# Altium project MarlinHardware.PrjPcb
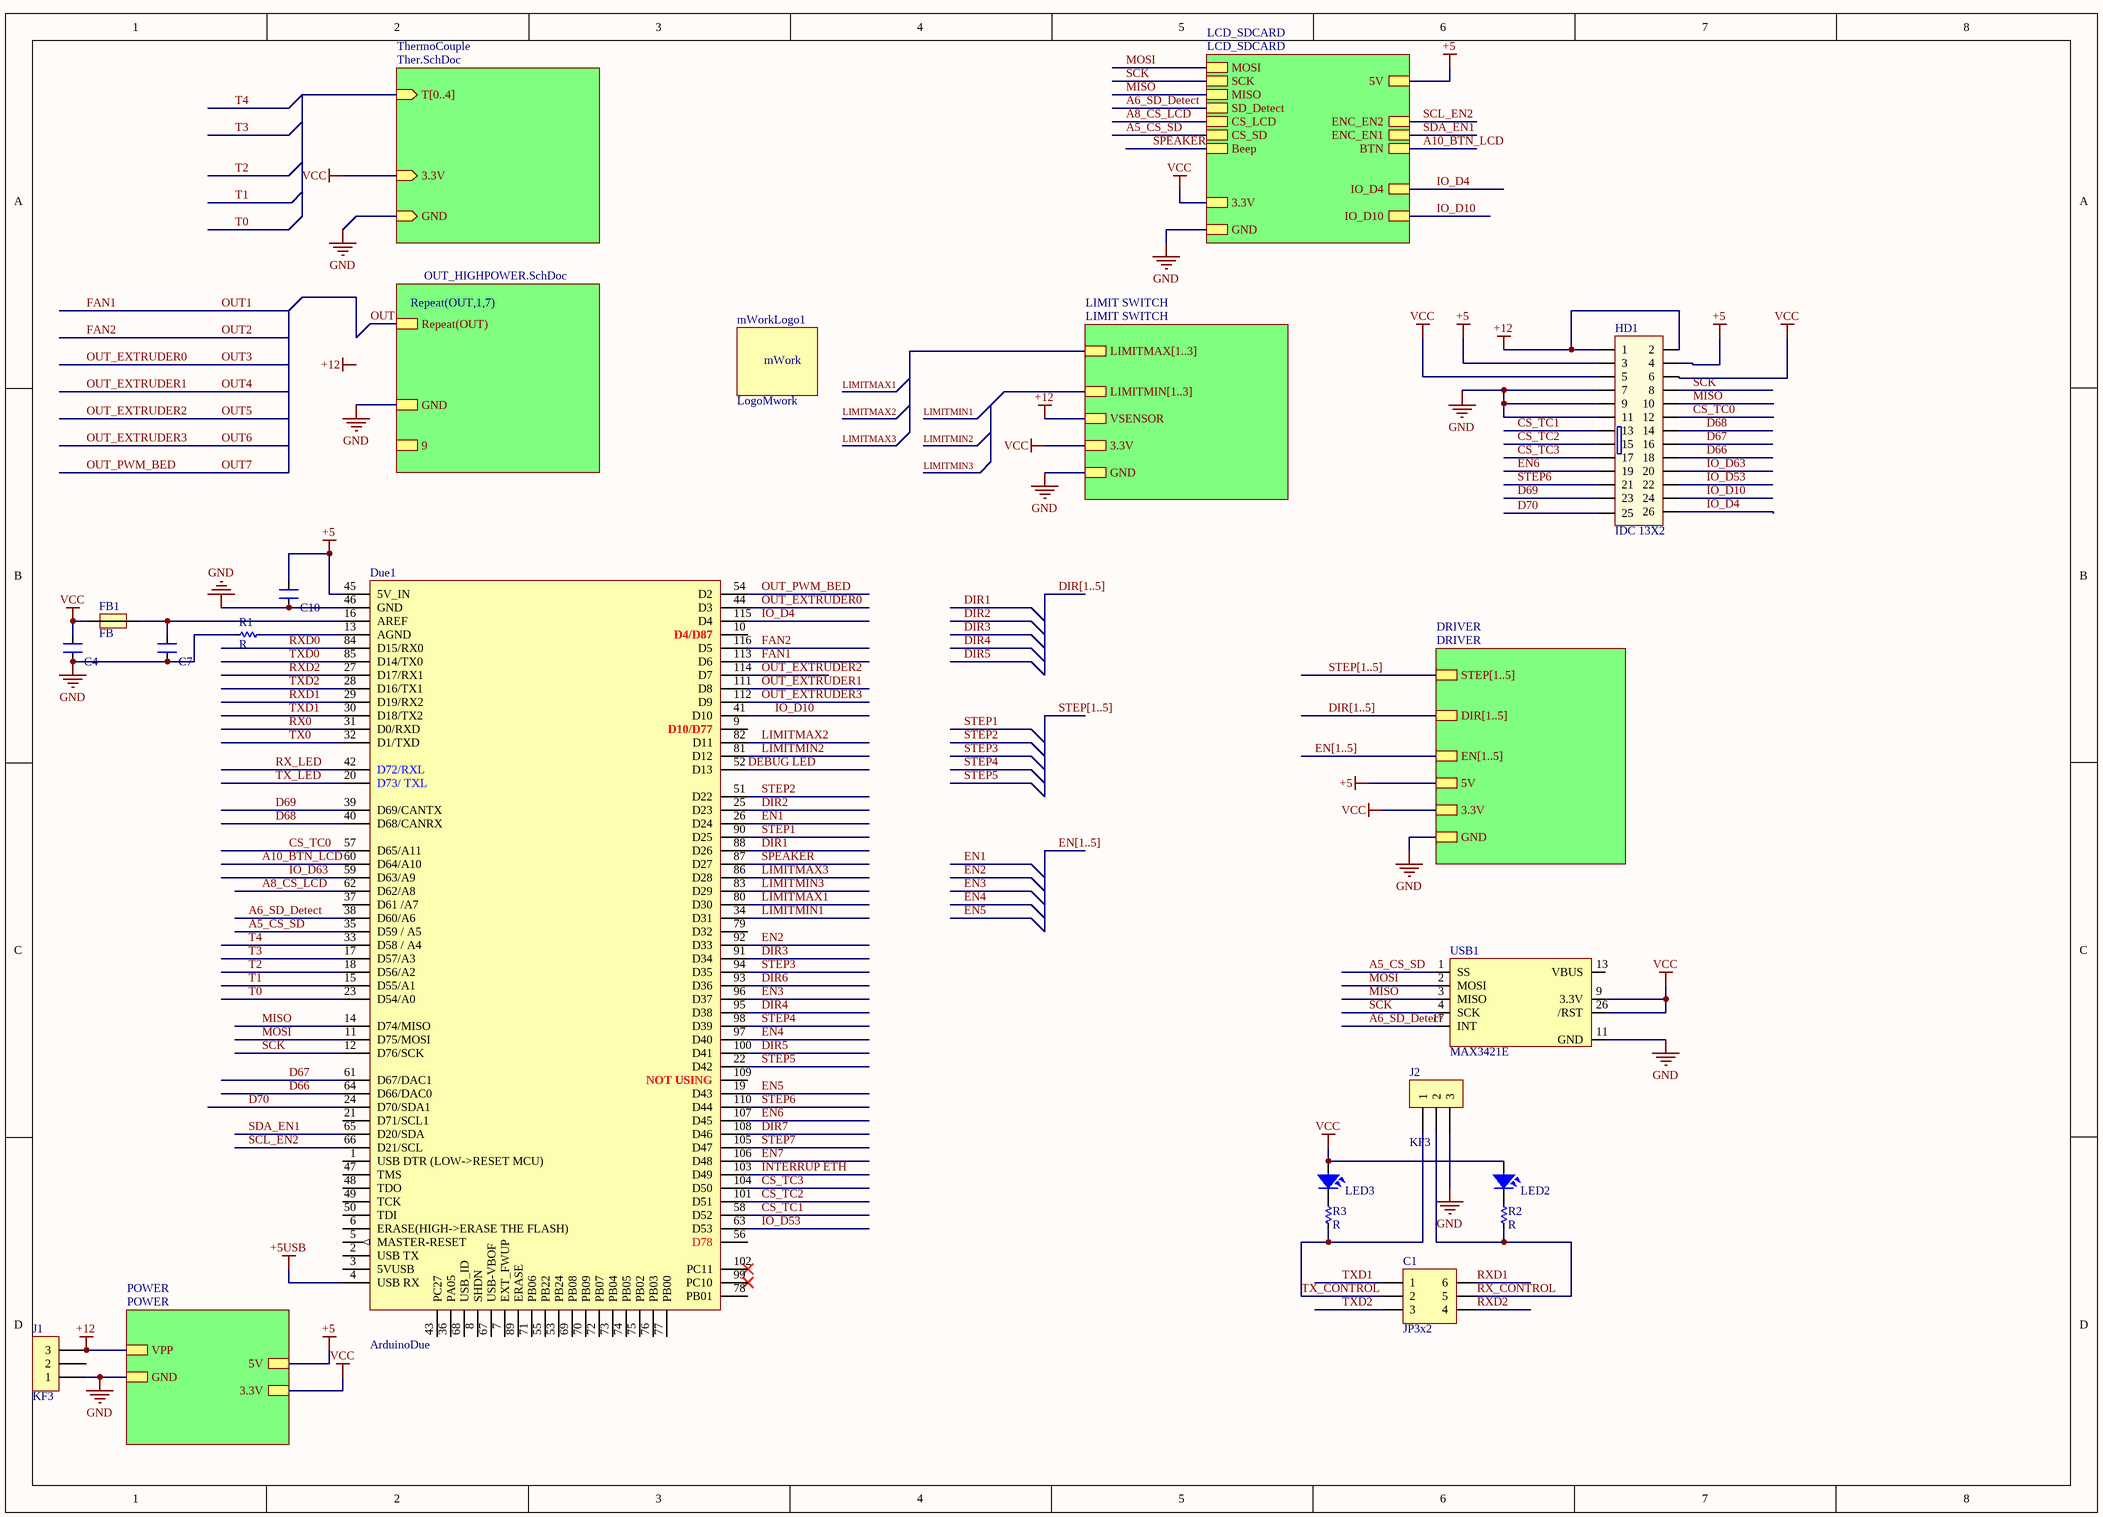
[diagram p0: mainMARLIN.SchDoc]
12 sheets, 297 parts. Net scope: hierarchical (ports join the sheet entries above them; power ports are global).
Board file: MARLIN.PcbDoc
Sheets:
  mainMARLIN.SchDoc
    POWER = POWER.SchDoc
    DRIVER = DRIVER.SchDoc
      Driver1 = DriverAxis.SchDoc
      Driver2 = DriverAxis.SchDoc
      Driver3 = DriverAxis.SchDoc
      Driver4 = DriverAxis.SchDoc
      Driver5 = DriverAxis.SchDoc
    LIMIT SWITCH = LIMIT SWITCH.SchDoc
      IN1 = inopto.SchDoc
      IN2 = inopto.SchDoc
      IN3 = inopto.SchDoc
      IN4 = inopto.SchDoc
      IN5 = inopto.SchDoc
      IN6 = inopto.SchDoc
    ThermoCouple = Ther.SchDoc
    OUT1 = OUT_HIGHPOWER.SchDoc
    OUT2 = OUT_HIGHPOWER.SchDoc
    OUT3 = OUT_HIGHPOWER.SchDoc
    OUT4 = OUT_HIGHPOWER.SchDoc
    OUT5 = OUT_HIGHPOWER.SchDoc
    OUT6 = OUT_HIGHPOWER.SchDoc
    OUT7 = OUT_HIGHPOWER.SchDoc
    LCD_SDCARD = LCD_SDCARD.SchDoc
  INOUT.SchDoc
  OUT.SchDoc
  IN.SchDoc

## Sheet mainMARLIN.SchDoc
size A3

### Parts
C1  JP3x2  [JP3-D2T]
C4  CN  [CN-SMD-0603_big]  (value not drawn)
C7  CN  [CN-SMD-0603_big]  (value not drawn)
C10  CN  [CN-SMD-0603_big]  (value not drawn)
Due1  ArduinoDue  [DUE_MODULE_SMT]
FB1  FB  [Capacitor_805]
HD1  IDC 13X2  [IDC26-B]
J1  KF3  [KF3-5.08T]
J2  KF3  [KF3-5.08T]
LED2  LED  [LED-0805-Blue]  (value not drawn)
LED3  LED  [LED-0805-Blue]  (value not drawn)
mWorkLogo1  LogoMwork  [LogoMwork15*6]
R1  R  [RES-SMD-0603_BIG]
R2  R  [RES-SMD-0603_BIG]
R3  R  [RES-SMD-0603_BIG]
USB1  MAX3421E  [USB_SHIELD]

### Sub-sheets
DRIVER = DRIVER: STEP[1..5], DIR[1..5], EN[1..5], GND, 5V, 3.3V
LCD_SDCARD = LCD_SDCARD: MOSI, ENC_EN1, 5V, MISO, SD_Detect, CS_LCD, ENC_EN2, BTN, CS_SD, 3.3V, SCK, GND, IO_D4, IO_D10, Beep
LIMIT SWITCH = LIMIT SWITCH: LIMITMAX[1..3], LIMITMIN[1..3], 3.3V, GND, VSENSOR
POWER = POWER: VPP, 5V, GND, 3.3V
Repeat(OUT,1,7) = OUT_HIGHPOWER.SchDoc: Repeat(OUT), GND, 9
ThermoCouple = Ther.SchDoc: T[0..4] (in), 3.3V (in), GND (in)

### Nets
+5: C10.2 Due1.45(5V_IN) HD1.3 HD1.4 ; sheet POWER/5V, sheet DRIVER/5V, sheet LCD_SDCARD/5V  [project net 5V]
+5USB: Due1.4(USB_RX)
+12: HD1.1 HD1.2 J1.3 ; sheet POWER/VPP, sheet LIMIT SWITCH/VSENSOR
GND: C4.1 C7.1 C10.1 Due1.46(GND) HD1.7 HD1.9 HD1.11 J1.1 J2.3 R1.2 USB1.11(GND) ; sheet POWER/GND, sheet DRIVER/GND, sheet LIMIT SWITCH/GND, sheet ThermoCouple/GND, sheet Repeat(OUT,1,7)/GND, sheet LCD_SDCARD/GND
VCC: C4.2 FB1.1 HD1.5 HD1.6 LED2.1 LED3.1 USB1.9(3.3V) USB1.26(/RST) ; sheet POWER/3.3V, sheet DRIVER/3.3V, sheet LIMIT SWITCH/3.3V, sheet ThermoCouple/3.3V, sheet LCD_SDCARD/3.3V  [project net 3.3V]
A5_CS_SD: Due1.35(D59_/_A5) USB1.1(SS) ; sheet LCD_SDCARD/CS_SD
A6_SD_Detect: Due1.38(D60/A6) USB1.17(INT) ; sheet LCD_SDCARD/SD_Detect
A8_CS_LCD: Due1.62(D62/A8) ; sheet LCD_SDCARD/CS_LCD
A10_BTN_LCD: Due1.60(D64/A10) ; sheet LCD_SDCARD/BTN
CS_TC0: Due1.57(D65/A11) HD1.12
CS_TC1: Due1.58(D52) HD1.13
CS_TC2: Due1.101(D51) HD1.15
CS_TC3: Due1.104(D50) HD1.17
D66: Due1.64(D66/DAC0) HD1.18
D67: Due1.61(D67/DAC1) HD1.16
D68: Due1.40(D68/CANRX) HD1.14
D69: Due1.39(D69/CANTX) HD1.23
D70: Due1.24(D70/SDA1) HD1.25
DEBUG LED: Due1.52(D13)
DIR1: Due1.88(D26)
DIR2: Due1.25(D23)
DIR3: Due1.91(D34)
DIR4: Due1.95(D38)
DIR5: Due1.100(D41)
DIR6: Due1.93(D36)
DIR7: Due1.108(D46)
EN1: Due1.26(D24)
EN2: Due1.92(D33)
EN3: Due1.96(D37)
EN4: Due1.97(D40)
EN5: Due1.19(D43)
EN6: Due1.107(D45) HD1.19
EN7: Due1.106(D48)
FAN1: Due1.113(D6)  [also labelled OUT1]
FAN2: Due1.116(D5)  [also labelled OUT2]
INTERRUP ETH: Due1.103(D49)
IO_D4: Due1.115(D4) HD1.26 ; sheet LCD_SDCARD/IO_D4
IO_D10: Due1.41(D10) HD1.24 ; sheet LCD_SDCARD/IO_D10
IO_D53: Due1.63(D53) HD1.22
IO_D63: Due1.59(D63/A9) HD1.20
LIMITMAX1: Due1.80(D30)
LIMITMAX2: Due1.82(D11)
LIMITMAX3: Due1.86(D28)
LIMITMIN1: Due1.34(D31)
LIMITMIN2: Due1.81(D12)
LIMITMIN3: Due1.83(D29)
MISO: Due1.14(D74/MISO) HD1.10 USB1.3(MISO) ; sheet LCD_SDCARD/MISO
MOSI: Due1.11(D75/MOSI) USB1.2(MOSI) ; sheet LCD_SDCARD/MOSI
OUT: sheet Repeat(OUT,1,7)/Repeat(OUT)
OUT3: Due1.44(D3)  [also labelled OUT_EXTRUDER0]
OUT4: Due1.111(D8)  [also labelled OUT_EXTRUDER1]
OUT5: Due1.114(D7)  [also labelled OUT_EXTRUDER2]
OUT6: Due1.112(D9)  [also labelled OUT_EXTRUDER3]
OUT7: Due1.54(D2)  [also labelled OUT_PWM_BED]
RX0: Due1.31(D0/RXD)
RX_CONTROL: C1.5 J2.2 R2.1
RX_LED: Due1.42(D72/RXL)
RXD0: Due1.84(D15/RX0)
RXD1: C1.6 Due1.29(D19/RX2)
RXD2: C1.4 Due1.27(D17/RX1)
SCK: Due1.12(D76/SCK) HD1.8 USB1.4(SCK) ; sheet LCD_SDCARD/SCK
SCL_EN2: Due1.66(D21/SCL) ; sheet LCD_SDCARD/ENC_EN2  [project net ENC_EN2]
SDA_EN1: Due1.65(D20/SDA) ; sheet LCD_SDCARD/ENC_EN1  [project net ENC_EN1]
SPEAKER: Due1.87(D27) ; sheet LCD_SDCARD/Beep  [project net LCD_Beep]
STEP1: Due1.90(D25)
STEP2: Due1.51(D22)
STEP3: Due1.94(D35)
STEP4: Due1.98(D39)
STEP5: Due1.22(D42)
STEP6: Due1.110(D44) HD1.21
STEP7: Due1.105(D47)
T0: Due1.23(D54/A0)
T1: Due1.15(D55/A1)
T2: Due1.18(D56/A2)
T3: Due1.17(D57/A3)
T4: Due1.33(D58_/_A4)
TX0: Due1.32(D1/TXD)
TX_CONTROL: C1.2 J2.1 R3.1
TX_LED: Due1.20(D73/_TXL)
TXD0: Due1.85(D14/TX0)
TXD1: C1.1 Due1.30(D18/TX2)
TXD2: C1.3 Due1.28(D16/TX1)
NetC7_2: C7.2 Due1.16(AREF) FB1.2
NetDue1_13: Due1.13(AGND) R1.1
NetLED2_2: LED2.2 R2.2
NetLED3_2: LED3.2 R3.2

Not connected (* = marked no-connect by the designer): Due1 1(USB_DTR_(LOW->RESET_MCU)) 2(USB_TX) 3(5VUSB) 5(MASTER-RESET) 6(ERASE(HIGH->ERASE_THE_FLASH)) 7(EXT_FWUP) 8(SHDN) 9(D10/D77) 10(D4/D87) 21(D71/SCL1) 36(PA05) 37(D61_/A7_) 43(PC27) 47(TMS) 48(TDO) 49(TCK) 50(TDI) 53(PB24) 55(PB22) 56(D78) 67(USB-VBOF) 68(USB_ID) 69(PB08) 70(PB09) 71(PB06) 72(PB07) 73(PB04) 74(PB05) 75(PB02) 76(PB03) 77(PB00) 78(PB01) 79(D32) 89(ERASE) 99(PC10)* 102(PC11)* 109(NOT_USING); J1 2; USB1 13(VBUS)

### Buses and harness runs
bus DIR[1..5]
bus DIR[1..5] = sheet DRIVER/DIR[1..5]
bus EN[1..5]
bus EN[1..5] = sheet DRIVER/EN[1..5]
bus STEP[1..5]
bus STEP[1..5] = sheet DRIVER/STEP[1..5]

### Notes on the sheet
- Labels drawn without touching a wire or pin: +12
- (in symbol LogoMwork) mWork

### Library data of the parts
C1 = JP3x2: WR-PHD 2.54 mm Dual Socket Header; Manufacturer: W¨¹rth Elektronik eiSos GmbH; partNo: 61300621821; ComponentLink1 Description: Manufacturer; ComponentLink2 Description: Datasheet; NoPins: 06; Created Date: 29 March 2013; ComponentLink1URL: http://www.we-online.com; ComponentLink2URL: http://katalog.we-online.de/em/datasheet/6130xx21821.pdf; Created by: Karrer Zheng
C4 C7 C10 = CN: Value: 33pF
HD1 = IDC 13X2: Value: Header 5x2
J1 J2 = KF3: Manufacturer: Würth Elektronik eiSos GmbH; partNo: 691103110003; ComponentLink1 Description: Manufacturer; ComponentLink2 Description: Datasheet; NoPins: 3; Created Date: 29 October 2013; ComponentLink1URL: http://www.we-online.com; ComponentLink2URL: http://katalog.we-online.de/em/datasheet/6911031100xx.pdf; Created by: Karrer Zheng
LED2 LED3 = LED SMD: Value: LED 3 - 5 ly 2 Colour
USB1 = USB_Shield_MAX3421E
Due1 = ArduinoDue: ComponentLink1Description: Buy; ComponentLink1URL: http://www.inhaos.com/product_info.php?products_id=164

## Sheet POWER.SchDoc
size A4
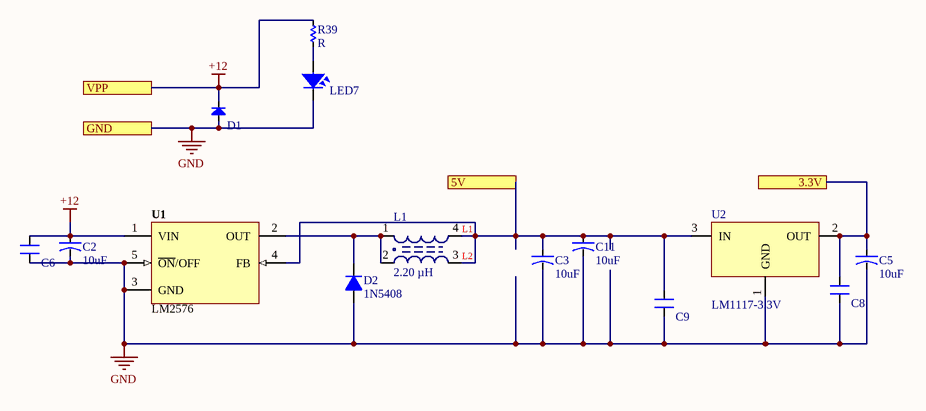
[diagram p1: POWER.SchDoc]

### Parts
C2  10uF  [CAP-ALU-SMD-6.3x7.7x2.2]
C3  10uF  [CAP-ALU-SMD-6.3x7.7x2.2]
C5  10uF  [CAP-ALU-SMD-6.3x7.7x2.2]
C6  CN  [CN-SMD-0603_big]  (value not drawn)
C8  CN  [CN-SMD-0603_big]  (value not drawn)
C9  CN  [CN-SMD-0603_big]  (value not drawn)
C11  10uF  [CAP-ALU-SMD-6.3x7.7x2.2]
D1  Diode  [DIO-SMD-214AC]  (value not drawn)
D2  1N5408  [D5AN]
L1  2.20 µH  [L-SMD-D-12.5x12.5]
LED7  LED  [LED-0805-Blue]  (value not drawn)
R39  R  [RES-SMD-0603_BIG]
U1  LM2576  [TO263]
U2  LM1117-3.3V  [SOT223]

### Ports
3.3V, 5V, GND, VPP

### Nets
3.3V: C5.1 C8.2 U2.2(OUT) ; port 3.3V
5V: C3.1 C9.2 C11.1 L1.3 L1.4 U1.4(FB) U2.3(IN) ; port 5V
+12: C2.1 C6.2 D1.2(K) R39.1 U1.1(VIN) ; port VPP
GND: C2.2 C3.2 C5.2 C6.1 C8.1 C9.1 C11.2 D1.1(A) D2.1(A) LED7.2 U1.3(GND) U1.5(~{ON}/OFF) U2.1(GND) ; port GND
NetD2_2: D2.2(K) L1.1 L1.2 U1.2(OUT)
NetLED7_1: LED7.1 R39.2

### Notes on the sheet
- (in symbol L-SMD-2) L2

### Library data of the parts
C2 C3 C5 C11 = CN-ALU-SMD: Polarized Capacitor (Axial); Published: 8-Jun-2000; LatestRevisionDate: 17-Jul-2002; LatestRevisionNote: Re-released for DXP Platform.; PackageReference: POLAR0.8; Publisher: Altium Limited
C6 C8 C9 = CN: Value: 33pF
D1 = Diode: Default Diode; Code - JEDEC: DO-214-AB; Value: 1N5007; Published: 8-Jun-2000; Revision: July-2002: Re-released for DXP Platform.; Publisher: Altium Limited; ComponentLink1Description: ES1J - STMBL; ComponentLink1URL: https://banlinhkien.vn/goods-8089-es1j-do214-diode-1a-600v-sma-es1j-.html
D2 = D5A: Diode 5A; Value: 1N5408
L1 = L-SMD-2: partNo: 7448709022; Manufacturer: Würth Elektronik eiSos GmbH; Inductance: 2.20 µH; ComponentLink1Description: Manufacturer; ComponentLink1URL: http://www.we-online.de; Created by: Christin Otto; Created Date: August 2013; ComponentLink2Description: Datasheet; ComponentLink2URL: http://katalog.we-online.de/pbs/datasheet/7448709022.pdf; ComponentLink3Description: THEGIOIIC; ComponentLink3URL: https://www.thegioiic.com/products/cuon-cam-33uh-rh127-smd-12x12x7
LED7 = LED SMD: Value: LED 3 - 5 ly 2 Colour
U1 = LM2576: Max Input Voltage: 12 V; Max Output Current: 3 (6.0 peak) A; Max Output Voltage: mV; Category: IC-Power; Min Input Voltage: mV; Min Output Voltage: mV; Mounting Technology: Surface Mount; Status: Unreleased; Supply Voltage: mV; Temperature Range: -40 to +125 degC; ComponentLink1Description: MUA; ComponentLink1URL: https://www.thegioiic.com/products/lm2596s-5-0
U2 = LM1117: 800mA Low-Dropout Linear Regulator; Creator: Nguyen Ba Bien; Website: http://group3i.net

## Sheet DRIVER.SchDoc
size A4
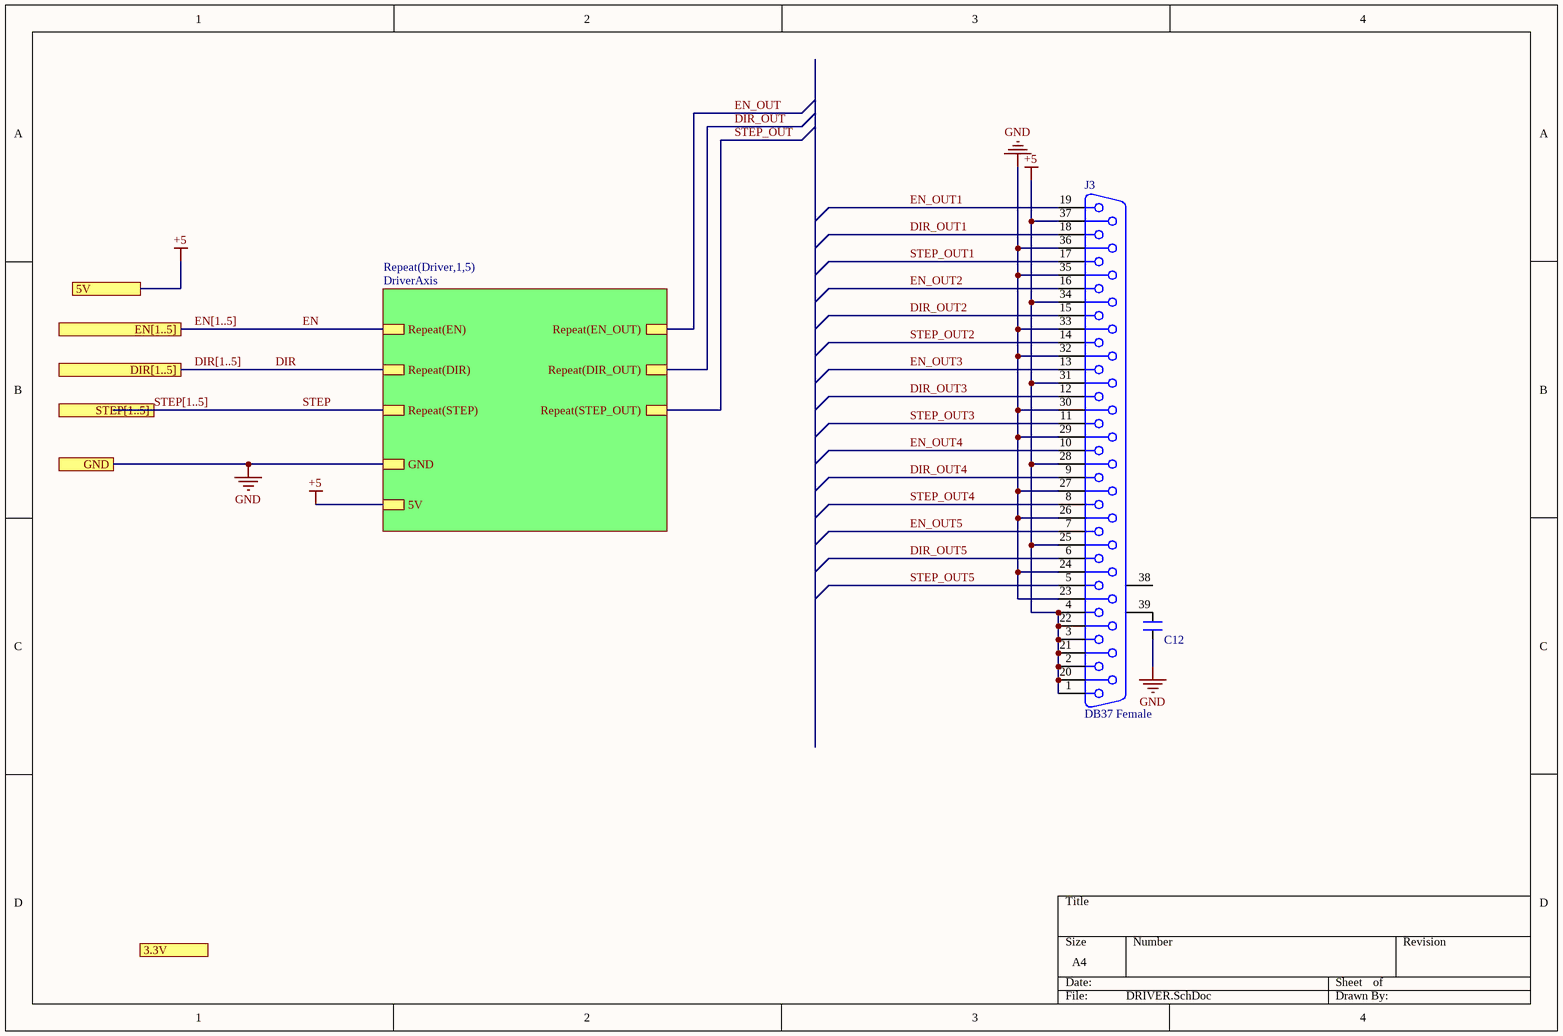
[diagram p2: DRIVER.SchDoc]

### Parts
C12  10uF  [CN-SMD-0603_big]  (value not drawn)
J3  DB37 Female  [DB37]

### Sub-sheets
Repeat(Driver,1,5) = DriverAxis: Repeat(EN), Repeat(DIR), Repeat(STEP), GND, Repeat(EN_OUT), Repeat(DIR_OUT), Repeat(STEP_OUT), 5V

### Ports
3.3V, 5V, DIR[1..5], EN[1..5], GND, STEP[1..5]

### Nets
+5: J3.1 J3.2 J3.3 J3.4 J3.20 J3.21 J3.22 J3.25 J3.28 J3.31 J3.34 J3.37 ; port 5V, sheet Repeat(Driver,1,5)/5V  [project net 5V]
GND: C12.1 J3.23 J3.24 J3.26 J3.27 J3.29 J3.30 J3.32 J3.33 J3.35 J3.36 ; port GND, sheet Repeat(Driver,1,5)/GND
DIR: sheet Repeat(Driver,1,5)/Repeat(DIR)
DIR_OUT: sheet Repeat(Driver,1,5)/Repeat(DIR_OUT)
DIR_OUT1: J3.18
DIR_OUT2: J3.15
DIR_OUT3: J3.12
DIR_OUT4: J3.9
DIR_OUT5: J3.6
EN: sheet Repeat(Driver,1,5)/Repeat(EN)
EN_OUT: sheet Repeat(Driver,1,5)/Repeat(EN_OUT)
EN_OUT1: J3.19
EN_OUT2: J3.16
EN_OUT3: J3.13
EN_OUT4: J3.10
EN_OUT5: J3.7
STEP: sheet Repeat(Driver,1,5)/Repeat(STEP)
STEP_OUT: sheet Repeat(Driver,1,5)/Repeat(STEP_OUT)
STEP_OUT1: J3.17
STEP_OUT2: J3.14
STEP_OUT3: J3.11
STEP_OUT4: J3.8
STEP_OUT5: J3.5
NetC12_2: C12.2 J3.39(MH2)

Not connected (* = marked no-connect by the designer): J3 38(MH1)

### Buses and harness runs
bus DIR[1..5] = port DIR[1..5]
bus EN[1..5] = port EN[1..5]
bus STEP[1..5] = port STEP[1..5]

### Library data of the parts
C12 = CN: Value: 33pF

## Sheet DriverAxis.SchDoc
size A
Used 5 times, as channels DRIVER/Driver1, DRIVER/Driver2, DRIVER/Driver3, DRIVER/Driver4, DRIVER/Driver5. Parts and nets are listed once, with the designators drawn on the sheet.
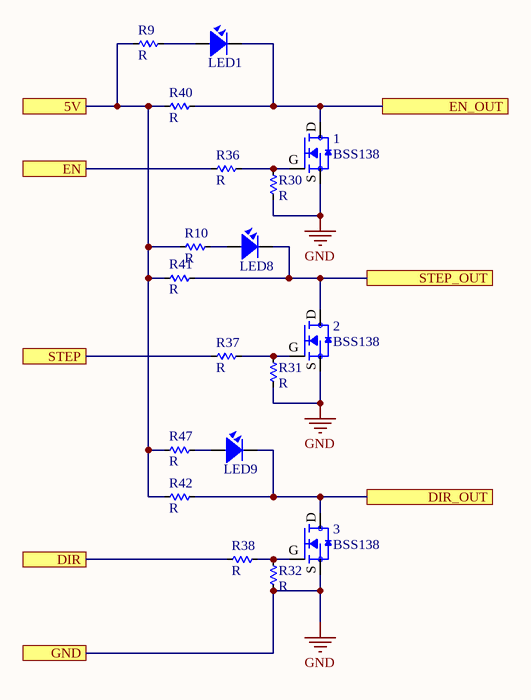
[diagram p3: DriverAxis.SchDoc]

### Parts
1  BSS138  [SOT23-bss138]
2  BSS138  [SOT23-bss138]
3  BSS138  [SOT23-bss138]
LED1  LED  [LED-0805-Blue]  (value not drawn)
LED8  LED  [LED-0805-Blue]  (value not drawn)
LED9  LED  [LED-0805-Blue]  (value not drawn)
R9  R  [RES-SMD-0603_BIG]
R10  R  [RES-SMD-0603_BIG]
R30  R  [RES-SMD-0603_BIG]
R31  R  [RES-SMD-0603_BIG]
R32  R  [RES-SMD-0603_BIG]
R36  R  [RES-SMD-0603_BIG]
R37  R  [RES-SMD-0603_BIG]
R38  R  [RES-SMD-0603_BIG]
R40  R  [RES-SMD-0603_BIG]
R41  R  [RES-SMD-0603_BIG]
R42  R  [RES-SMD-0603_BIG]
R47  R  [RES-SMD-0603_BIG]

### Ports
5V, DIR, DIR_OUT, EN, EN_OUT, GND, STEP, STEP_OUT

### Nets
GND: 1.S 2.S 3.S R30.2 R31.2 R32.2 ; port GND
5V: R9.1 R10.1 R40.1 R41.1 R42.1 R47.1 ; port 5V
DIR: R38.1 ; port DIR
DIR_OUT: 3.D LED9.2 R42.2 ; port DIR_OUT
EN: R36.1 ; port EN
EN_OUT: 1.D LED1.2 R40.2 ; port EN_OUT
STEP: R37.1 ; port STEP
STEP_OUT: 2.D LED8.2 R41.2 ; port STEP_OUT
Net1_G: 1.G R30.1 R36.2
Net2_G: 2.G R31.1 R37.2
Net3_G: 3.G R32.1 R38.2
NetLED1_1: LED1.1 R9.2
NetLED8_1: LED8.1 R10.2
NetLED9_1: LED9.1 R47.2

### Channels
DRIVER/Driver1: designators end in _Driver1; ports 5V=5V DIR=DIR1 DIR_OUT=DIR_OUT1 EN=EN1 EN_OUT=EN_OUT1 GND=GND STEP=STEP1 STEP_OUT=STEP_OUT1
DRIVER/Driver2: designators end in _Driver2; ports 5V=5V DIR=DIR2 DIR_OUT=DIR_OUT2 EN=EN2 EN_OUT=EN_OUT2 GND=GND STEP=STEP2 STEP_OUT=STEP_OUT2
DRIVER/Driver3: designators end in _Driver3; ports 5V=5V DIR=DIR3 DIR_OUT=DIR_OUT3 EN=EN3 EN_OUT=EN_OUT3 GND=GND STEP=STEP3 STEP_OUT=STEP_OUT3
DRIVER/Driver4: designators end in _Driver4; ports 5V=5V DIR=DIR4 DIR_OUT=DIR_OUT4 EN=EN4 EN_OUT=EN_OUT4 GND=GND STEP=STEP4 STEP_OUT=STEP_OUT4
DRIVER/Driver5: designators end in _Driver5; ports 5V=5V DIR=DIR5 DIR_OUT=DIR_OUT5 EN=EN5 EN_OUT=EN_OUT5 GND=GND STEP=STEP5 STEP_OUT=STEP_OUT5

### Library data of the parts
1-3 = BSS138: N-Channel 50V 220mA _Ta_ 360mW _Ta_ Surface Mount Die; MF: MICROSS/On Semiconductor; Value: *; SnapEDA_Link: https://www.snapeda.com/parts/BSS138/MICROSS/On%20Semiconductor/view-part/2773844/?ref=snap; MP: BSS138; Availability: Unavailable; Price: None; Package: TO-236-3 Micross
LED1 LED8 LED9 = LED SMD: Value: LED 3 - 5 ly 2 Colour

## Sheet LIMIT SWITCH.SchDoc
size A4
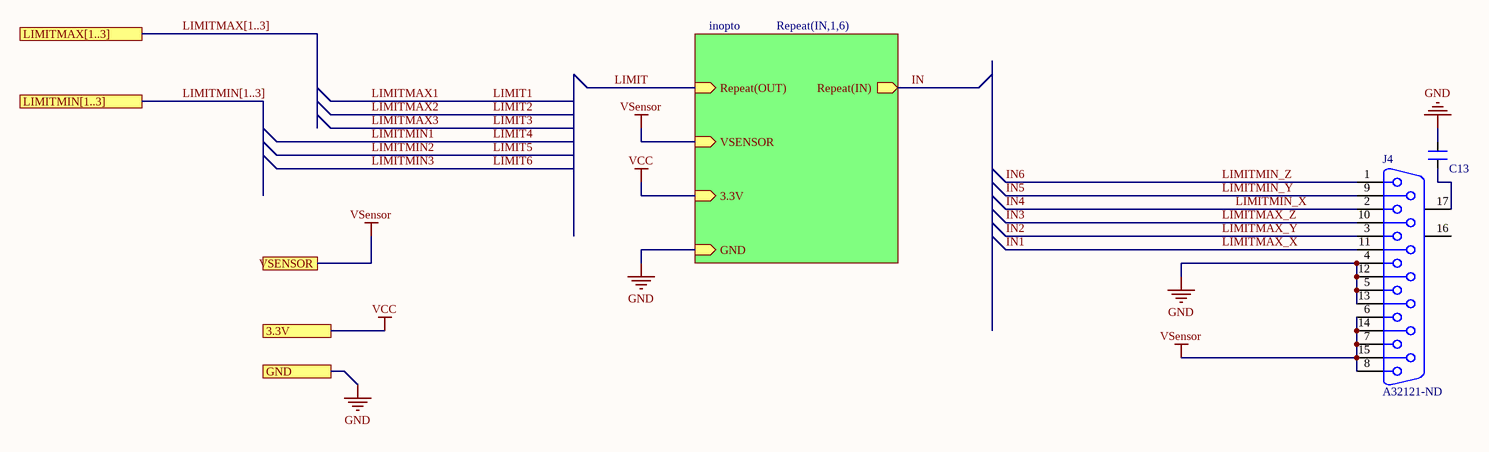
[diagram p4: LIMIT SWITCH.SchDoc]

### Parts
C13  CN  [CN-SMD-0603_big]  (value not drawn)
J4  A32121-ND  [DB15]

### Sub-sheets
Repeat(IN,1,6) = inopto: Repeat(OUT) (in), Repeat(IN) (out), VSENSOR (in), 3.3V (in), GND (in)

### Ports
3.3V, GND, LIMITMAX[1..3], LIMITMIN[1..3], VSENSOR

### Nets
GND: C13.2 J4.4 J4.5 J4.12 J4.13 ; port GND, sheet Repeat(IN,1,6)/GND
VCC: port 3.3V, sheet Repeat(IN,1,6)/3.3V  [project net 3.3V]
VSensor: J4.6 J4.7 J4.8 J4.14 J4.15 ; port VSENSOR, sheet Repeat(IN,1,6)/VSENSOR  [project net +12]
IN: sheet Repeat(IN,1,6)/Repeat(IN)
IN1: J4.11  [also labelled LIMITMAX_X]
IN2: J4.3  [also labelled LIMITMAX_Y]
IN3: J4.10  [also labelled LIMITMAX_Z]
IN4: J4.2  [also labelled LIMITMIN_X]
IN5: J4.9  [also labelled LIMITMIN_Y]
IN6: J4.1  [also labelled LIMITMIN_Z]
LIMIT: sheet Repeat(IN,1,6)/Repeat(OUT)
NetC13_1: C13.1 J4.17(MH2)

Not connected (* = marked no-connect by the designer): J4 16(MH1)

### Buses and harness runs
bus LIMITMAX[1..3] = port LIMITMAX[1..3]
bus LIMITMIN[1..3] = port LIMITMIN[1..3]

### Library data of the parts
C13 = CN: Value: 33pF
J4 = DB15: Receptacle Assembly, 15 Position, Right Angle; PackageDocument: O; Positions: 15; Published: 15-Jun-2001; LatestRevisionDate: 17-Jul-2002; LatestRevisionNote: Re-released for DXP Platform.; DatasheetDocument: 1-Sep-99; PackageReference: 788757; Publisher: Altium Limited; Orientation: Right Angle; Gender: Receptacle

## Sheet inopto.SchDoc
size A4
Used 6 times, as channels LIMIT SWITCH/IN1, LIMIT SWITCH/IN2, LIMIT SWITCH/IN3, LIMIT SWITCH/IN4, LIMIT SWITCH/IN5, LIMIT SWITCH/IN6. Parts and nets are listed once, with the designators drawn on the sheet.
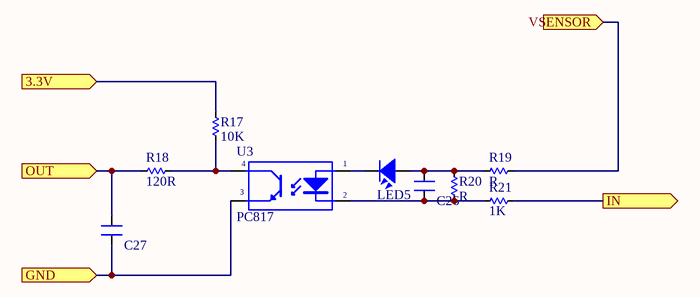
[diagram p5: inopto.SchDoc]

### Parts
C26  CN  [CN-SMD-0603_big]  (value not drawn)
C27  CN  [CN-SMD-0603_big]  (value not drawn)
LED5  MinZ  [LED-0805-Blue]  (value not drawn)
R17  10K  [RES-SMD-0603_BIG]
R18  120R  [RES-SMD-0603_BIG]
R19  R  [RES-SMD-0603_BIG]
R20  R  [RES-SMD-0603_BIG]
R21  1K  [RES-SMD-0603_BIG]
U3  PC817  [PC817SMT]

### Ports
3.3V (in), GND (in), IN (out), OUT (in), VSENSOR (in)

### Nets
3.3V: R17.1 ; port 3.3V
GND: C27.1 U3.3(E) ; port GND
IN: R21.1 ; port IN
OUT: C27.2 R18.1 ; port OUT
VSENSOR: R19.1 ; port VSENSOR
NetC26_1: C26.1 R20.2 R21.2 U3.2(K)
NetC26_2: C26.2 LED5.1 R19.2 R20.1
NetLED5_2: LED5.2 U3.1(A)
NetR17_2: R17.2 R18.2 U3.4(C)

### Channels
LIMIT SWITCH/IN1: designators end in _IN1; ports 3.3V=3.3V GND=GND IN=IN1 OUT=LIMIT1 VSENSOR=+12
LIMIT SWITCH/IN2: designators end in _IN2; ports 3.3V=3.3V GND=GND IN=IN2 OUT=LIMIT2 VSENSOR=+12
LIMIT SWITCH/IN3: designators end in _IN3; ports 3.3V=3.3V GND=GND IN=IN3 OUT=LIMIT3 VSENSOR=+12
LIMIT SWITCH/IN4: designators end in _IN4; ports 3.3V=3.3V GND=GND IN=IN4 OUT=LIMIT4 VSENSOR=+12
LIMIT SWITCH/IN5: designators end in _IN5; ports 3.3V=3.3V GND=GND IN=IN5 OUT=LIMIT5 VSENSOR=+12
LIMIT SWITCH/IN6: designators end in _IN6; ports 3.3V=3.3V GND=GND IN=IN6 OUT=LIMIT6 VSENSOR=+12

### Library data of the parts
C26 C27 = CN: Value: 33pF
LED5 = LED SMD: Value: LED 3 - 5 ly 2 Colour
R17 R18 R21 = R
U3 = PC817: Single Opto; Value: PC817

## Sheet Ther.SchDoc
size A4
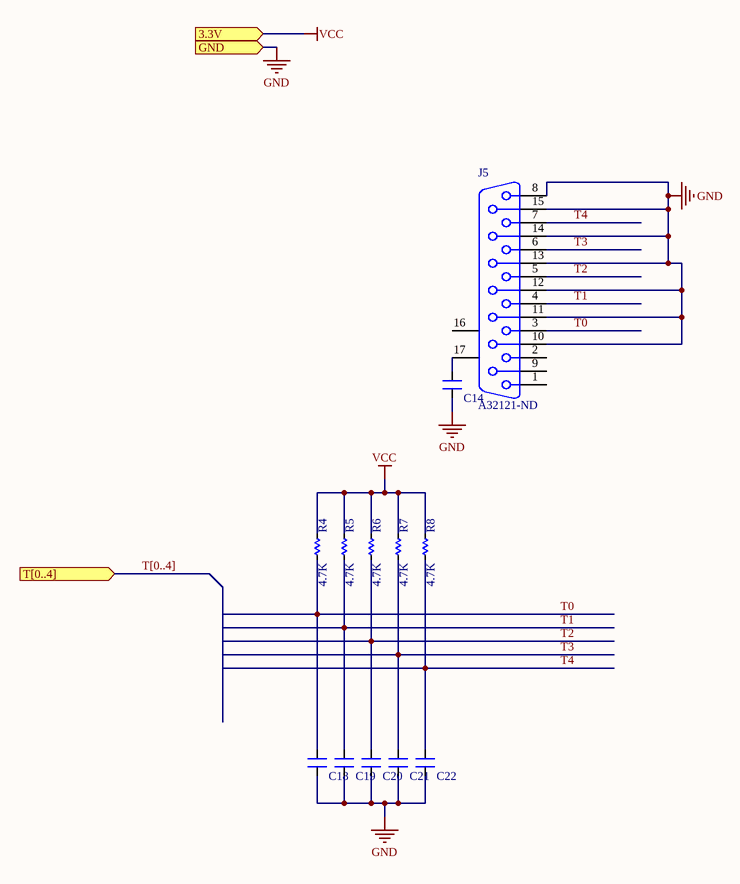
[diagram p6: Ther.SchDoc]

### Parts
C14  10uF  [CN-SMD-0603_big]  (value not drawn)
C18  10uF  [CN-SMD-0603_big]  (value not drawn)
C19  10uF  [CN-SMD-0603_big]  (value not drawn)
C20  10uF  [CN-SMD-0603_big]  (value not drawn)
C21  10uF  [CN-SMD-0603_big]  (value not drawn)
C22  10uF  [CN-SMD-0603_big]  (value not drawn)
J5  A32121-ND  [DB15]
R4  4.7K  [RES-SMD-0603_BIG]
R5  4.7K  [RES-SMD-0603_BIG]
R6  4.7K  [RES-SMD-0603_BIG]
R7  4.7K  [RES-SMD-0603_BIG]
R8  4.7K  [RES-SMD-0603_BIG]

### Ports
3.3V (in), GND (in), T[0..4] (in)

### Nets
GND: C14.1 C18.1 C19.1 C20.1 C21.1 C22.1 J5.8 J5.10 J5.11 J5.12 J5.13 J5.14 J5.15 ; port GND
VCC: R4.1 R5.1 R6.1 R7.1 R8.1 ; port 3.3V  [project net 3.3V]
T0: C18.2 J5.3 R4.2
T1: C19.2 J5.4 R5.2
T2: C20.2 J5.5 R6.2
T3: C21.2 J5.6 R7.2
T4: C22.2 J5.7 R8.2
NetC14_2: C14.2 J5.17(MH2)

Not connected (* = marked no-connect by the designer): J5 1 2 9 16(MH1)

### Buses and harness runs
bus T[0..4] = port T[0..4]

### Library data of the parts
C14 C18-C22 = CN: Value: 33pF
J5 = DB15: as J4 on sheet LIMIT SWITCH; Published: 15-Jun-2001; LatestRevisionDate: 17-Jul-2002; LatestRevisionNote: Re-released for DXP Platform.; DatasheetDocument: 1-Sep-99; PackageReference: 788757; Publisher: Altium Limited; Orientation: Right Angle; Gender: Receptacle
R4-R8 = R

## Sheet OUT_HIGHPOWER.SchDoc
size A4
Used 7 times, as channels OUT1, OUT2, OUT3, OUT4, OUT5, OUT6, OUT7. Parts and nets are listed once, with the designators drawn on the sheet.
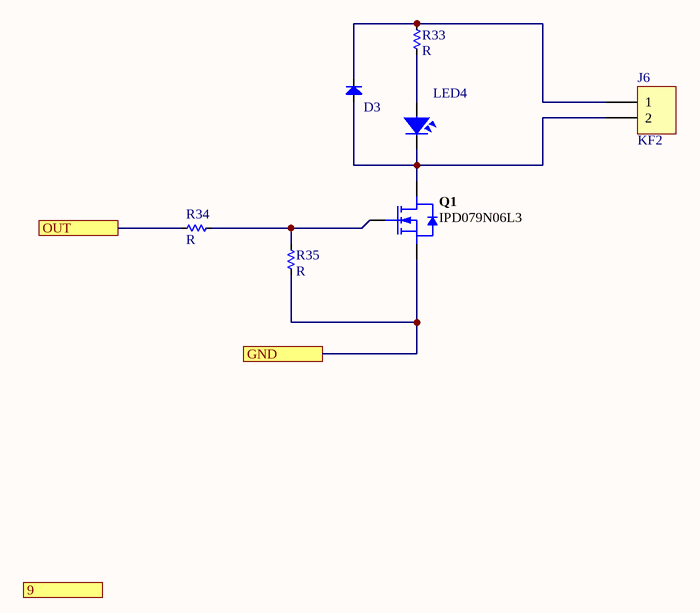
[diagram p7: OUT_HIGHPOWER.SchDoc]

### Parts
D3  Diode  [DIO-SMD-106-HayDung]  (value not drawn)
J6  KF2  [KF2-5.08T]
LED4  LED  [LED-0805-Blue]  (value not drawn)
Q1  IPD079N06L3  [TO252-3]
R33  R  [RES-SMD-0603_BIG]
R34  R  [RES-SMD-0603_BIG]
R35  R  [RES-SMD-0603_BIG]

### Ports
9, GND, OUT

### Nets
GND: Q1.3(S) R35.1 ; port GND
OUT: R34.1 ; port OUT
NetD3_1: D3.1(A) J6.2 LED4.2 Q1.2(D)
NetD3_2: D3.2(K) J6.1 R33.2
NetLED4_1: LED4.1 R33.1
NetQ1_1: Q1.1(G) R34.2 R35.2

### Channels
OUT1: designators end in _OUT1; ports 9=open GND=GND OUT=FAN1
OUT2: designators end in _OUT2; ports 9=open GND=GND OUT=FAN2
OUT3: designators end in _OUT3; ports 9=open GND=GND OUT=OUT3
OUT4: designators end in _OUT4; ports 9=open GND=GND OUT=OUT4
OUT5: designators end in _OUT5; ports 9=open GND=GND OUT=OUT5
OUT6: designators end in _OUT6; ports 9=open GND=GND OUT=OUT6
OUT7: designators end in _OUT7; ports 9=open GND=GND OUT=OUT7

### Library data of the parts
D3 = Diode: as D1 on sheet POWER; Published: 8-Jun-2000; Revision: July-2002: Re-released for DXP Platform.; Publisher: Altium Limited; ComponentLink1Description: ES1J - STMBL; ComponentLink1URL: https://banlinhkien.vn/goods-8089-es1j-do214-diode-1a-600v-sma-es1j-.html
J6 = KF2: Manufacturer: Würth Elektronik eiSos GmbH; partNo: 691103110002; ComponentLink1 Description: Manufacturer; ComponentLink2 Description: Datasheet; NoPins: 2; Created Date: 29 October 2013; ComponentLink1URL: http://www.we-online.com; ComponentLink2URL: http://katalog.we-online.de/em/datasheet/6911031100xx.pdf; Created by: Karrer Zheng
LED4 = LED SMD: Value: LED 3 - 5 ly 2 Colour
Q1 = FET_N: IPD079N06L3 - TO-252-3; Transistor Type: NPN; Mounting Technology: Surface Mount; Status: Unreleased; Category: Transistor-FET

## Sheet LCD_SDCARD.SchDoc
size A
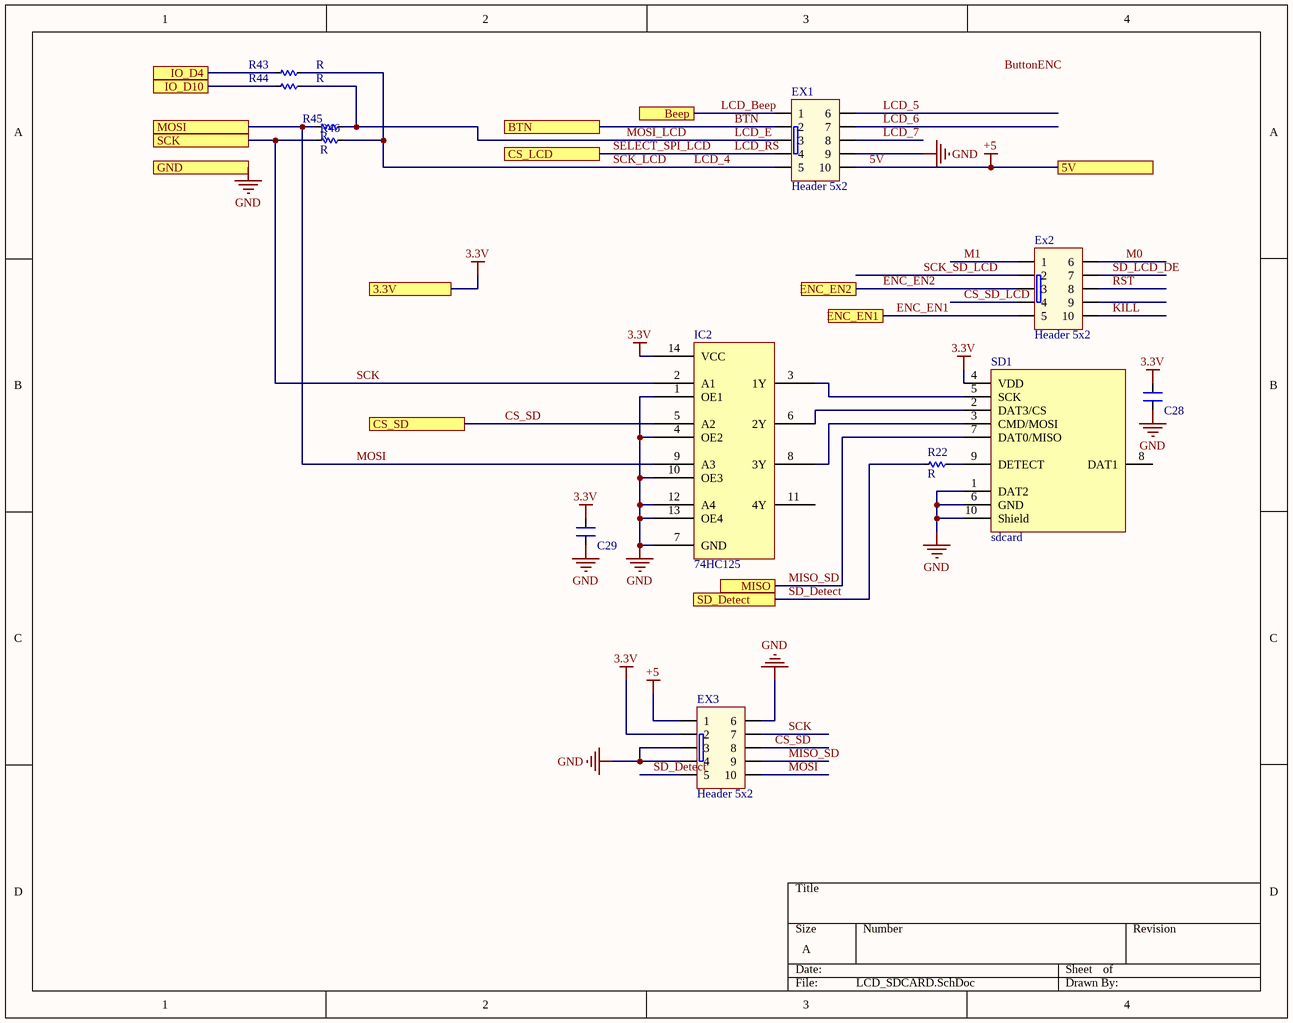
[diagram p8: LCD_SDCARD.SchDoc]

### Parts
C28  CN  [CN-SMD-0603_big]  (value not drawn)
C29  CN  [CN-SMD-0603_big]  (value not drawn)
EX1  Header 5x2  [Hed2X5]
Ex2  Header 5x2  [Hed2X5]
EX3  Header 5x2  [Hed2X5]
IC2  74HC125  [SO14]
R22  R  [RES-SMD-0603_BIG]
R43  R  [RES-SMD-0603_BIG]
R44  R  [RES-SMD-0603_BIG]
R45  R  [RES-SMD-0603_BIG]
R46  R  [RES-SMD-0603_BIG]
SD1  sdcard  [microSD™ Card_TF]

### Ports
3.3V, 5V, Beep, BTN, CS_LCD, CS_SD, ENC_EN1, ENC_EN2, GND, IO_D4, IO_D10, MISO, MOSI, SCK, SD_Detect

### Nets
3.3V: C28.2 C29.2 EX3.2 IC2.14(VCC) SD1.4(VDD) ; port 3.3V
5V: EX1.10 EX3.1 ; port 5V  [also labelled +5]
GND: C28.1 C29.1 EX1.9 EX3.3 EX3.4 EX3.6 IC2.1(OE1) IC2.4(OE2) IC2.7(GND) IC2.10(OE3) IC2.12(A4) IC2.13(OE4) SD1.1(DAT2) SD1.6(GND) SD1.10(Shield) ; port GND
BTN: EX1.2 ; port BTN  [project net A10_BTN_LCD]
CS_SD: EX3.8 IC2.5(A2) ; port CS_SD  [project net A5_CS_SD]
CS_SD_LCD: Ex2.4
ENC_EN1: Ex2.5 ; port ENC_EN1
ENC_EN2: Ex2.3 ; port ENC_EN2
IO_D4: R43.2 ; port IO_D4
IO_D10: R44.2 ; port IO_D10
KILL: Ex2.10
LCD_4: EX1.5 R43.1 R46.1  [also labelled SCK_LCD]
LCD_5: EX1.6
LCD_6: EX1.7
LCD_7: EX1.8
LCD_Beep: EX1.1 ; port Beep
LCD_E: EX1.3 R44.1 R45.1  [also labelled MOSI_LCD]
LCD_RS: EX1.4 ; port CS_LCD  [also labelled SELECT_SPI_LCD]  [project net A8_CS_LCD]
M0: Ex2.6
M1: Ex2.1
MISO_SD: EX3.9 SD1.7(DAT0/MISO) ; port MISO  [project net MISO]
MOSI: EX3.10 IC2.9(A3) R45.2 ; port MOSI
RST: Ex2.8
SCK: EX3.7 IC2.2(A1) R46.2 ; port SCK
SCK_SD_LCD: Ex2.2
SD_Detect: EX3.5 R22.2 ; port SD_Detect  [project net A6_SD_Detect]
SD_LCD_DE: Ex2.7
NetIC2_3: IC2.3(1Y) SD1.5(SCK)
NetIC2_6: IC2.6(2Y) SD1.2(DAT3/CS)
NetIC2_8: IC2.8(3Y) SD1.3(CMD/MOSI)
NetR22_1: R22.1 SD1.9(DETECT)

Not connected (* = marked no-connect by the designer): Ex2 9; IC2 11(4Y); SD1 8(DAT1)

### Notes on the sheet
- Labels drawn without touching a wire or pin: ButtonENC

### Library data of the parts
C28 C29 = CN: Value: 33pF
EX1 Ex2 EX3 = HED5x2: Value: Header 5x2

## Sheet INOUT.SchDoc
size A
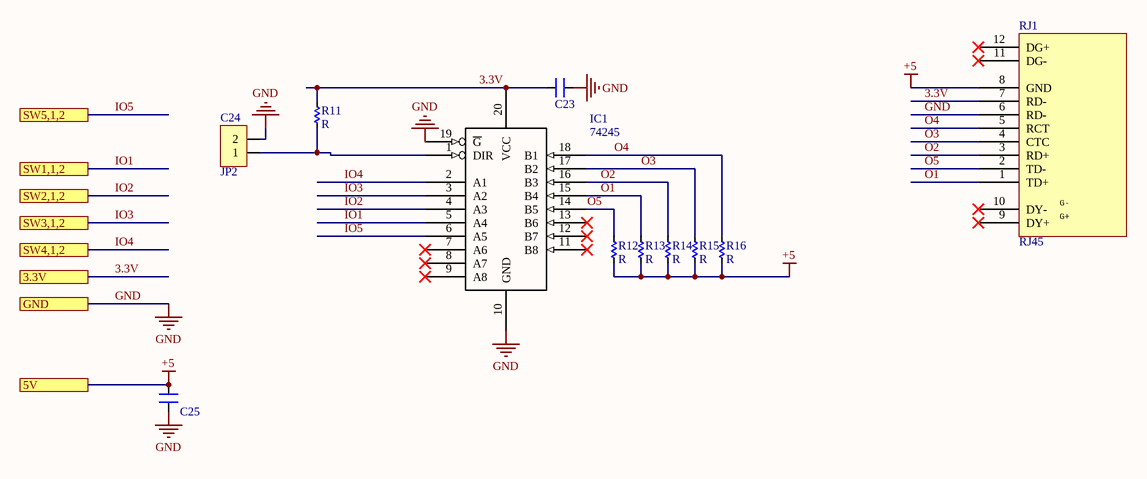
[diagram p9: INOUT.SchDoc]

### Parts
C23  CN  [CN-SMD-0603_big]  (value not drawn)
C24  JP2  [JP2-CLOSED]
C25  CN  [CN-SMD-0603_big]  (value not drawn)
IC1  74245  [SO20]
R11  R  [RES-SMD-0603_BIG]
R12  R  [RES-SMD-0603_BIG]
R13  R  [RES-SMD-0603_BIG]
R14  R  [RES-SMD-0603_BIG]
R15  R  [RES-SMD-0603_BIG]
R16  R  [RES-SMD-0603_BIG]
RJ1  RJ45  [RJ45-Dung]

### Ports
3.3V, 5V, GND, SW1,1,2, SW2,1,2, SW3,1,2, SW4,1,2, SW5,1,2

### Nets
+5: C25.2 R12.2 R13.2 R14.2 R15.2 R16.2 RJ1.8(GND) ; port 5V  [project net 5V]
GND: C23.2 C24.2 C25.1 IC1.10(GND) IC1.19(~{G}) RJ1.6(RD-) ; port GND
3.3V: C23.1 IC1.20(VCC) R11.1 RJ1.7(RD-) ; port 3.3V
IO1: IC1.5(A4) ; port SW1,1,2
IO2: IC1.4(A3) ; port SW2,1,2
IO3: IC1.3(A2) ; port SW3,1,2
IO4: IC1.2(A1) ; port SW4,1,2
IO5: IC1.6(A5) ; port SW5,1,2
O1: IC1.15(B4) R13.1 RJ1.1(TD+)
O2: IC1.16(B3) R14.1 RJ1.3(RD+)
O3: IC1.17(B2) R15.1 RJ1.4(CTC)
O4: IC1.18(B1) R16.1 RJ1.5(RCT)
O5: IC1.14(B5) R12.1 RJ1.2(TD-)
NetC24_1: C24.1 IC1.1(DIR) R11.2

Not connected (* = marked no-connect by the designer): IC1 7(A6)* 8(A7)* 9(A8)* 11(B8)* 12(B7)* 13(B6)*; RJ1 9(DY+)* 10(DY-)* 11(DG-)* 12(DG+)*

### Notes on the sheet
- (in symbol CON JR45) G-; G+

### Library data of the parts
C23 C25 = CN: Value: 33pF
C24 = JP2: WR-PHD 2.54 mm Angled Socket Header; Manufacturer: W¨¹rth Elektronik eiSos GmbH; partNo: 613002143121; ComponentLink1 Description: Manufacturer; ComponentLink2 Description: Datasheet; NoPins: 02; Created Date: 29 March 2013; ComponentLink1URL: http://www.we-online.com; ComponentLink2URL: http://katalog.we-online.de/em/datasheet/6130xx143121.pdf; Created by: Karrer Zheng
IC1 = 74245: Octal bus tranceiver; 3-state; Copyright by: VanDungEvn@gmail.com
RJ1 = CON JR45: ComponentLink1Description: Mua; ComponentLink1URL: https://thegioiic.com/products/rj45-top-cong-rj45-top-180-do

## Sheet OUT.SchDoc
size A4
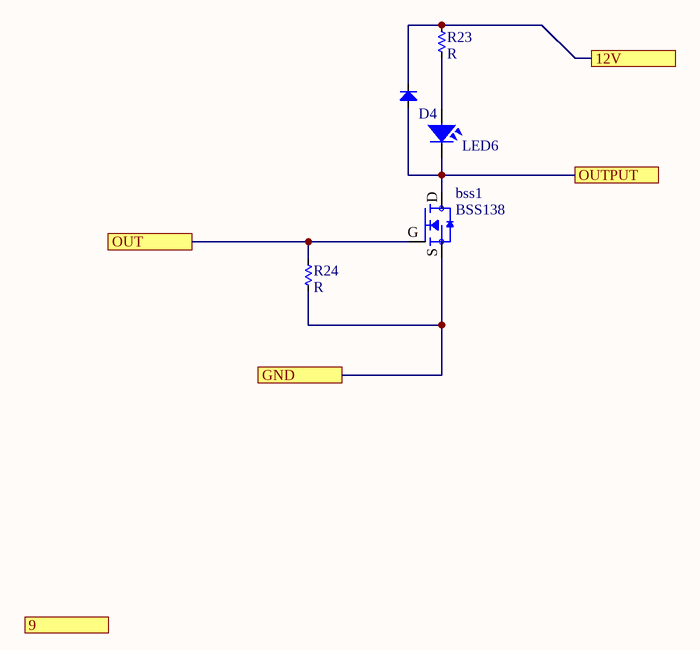
[diagram p10: OUT.SchDoc]

### Parts
bss1  BSS138  [SOT23-bss138]
D4  Diode  [DIO-SMD-123]  (value not drawn)
LED6  LED  [LED-0805-Blue]  (value not drawn)
R23  R  [RES-SMD-0603_BIG]
R24  R  [RES-SMD-0603_BIG]

### Ports
9, 12V, GND, OUT, OUTPUT

### Nets
Netbss1_D: bss1.D D4.1(A) LED6.2 ; port OUTPUT
Netbss1_G: bss1.G R24.1 ; port OUT
Netbss1_S: bss1.S R24.2 ; port GND
NetD4_2: D4.2(K) R23.1 ; port 12V
NetLED6_1: LED6.1 R23.2

### Library data of the parts
bss1 = BSS138: as 1 on sheet DriverAxis; Value: *; SnapEDA_Link: https://www.snapeda.com/parts/BSS138/MICROSS/On%20Semiconductor/view-part/2773844/?ref=snap; MP: BSS138; Availability: Unavailable; Price: None; Package: TO-236-3 Micross
D4 = Diode: as D1 on sheet POWER; Published: 8-Jun-2000; Revision: July-2002: Re-released for DXP Platform.; Publisher: Altium Limited; ComponentLink1Description: ES1J - STMBL; ComponentLink1URL: https://banlinhkien.vn/goods-8089-es1j-do214-diode-1a-600v-sma-es1j-.html
LED6 = LED SMD: Value: LED 3 - 5 ly 2 Colour

## Sheet IN.SchDoc
size A4
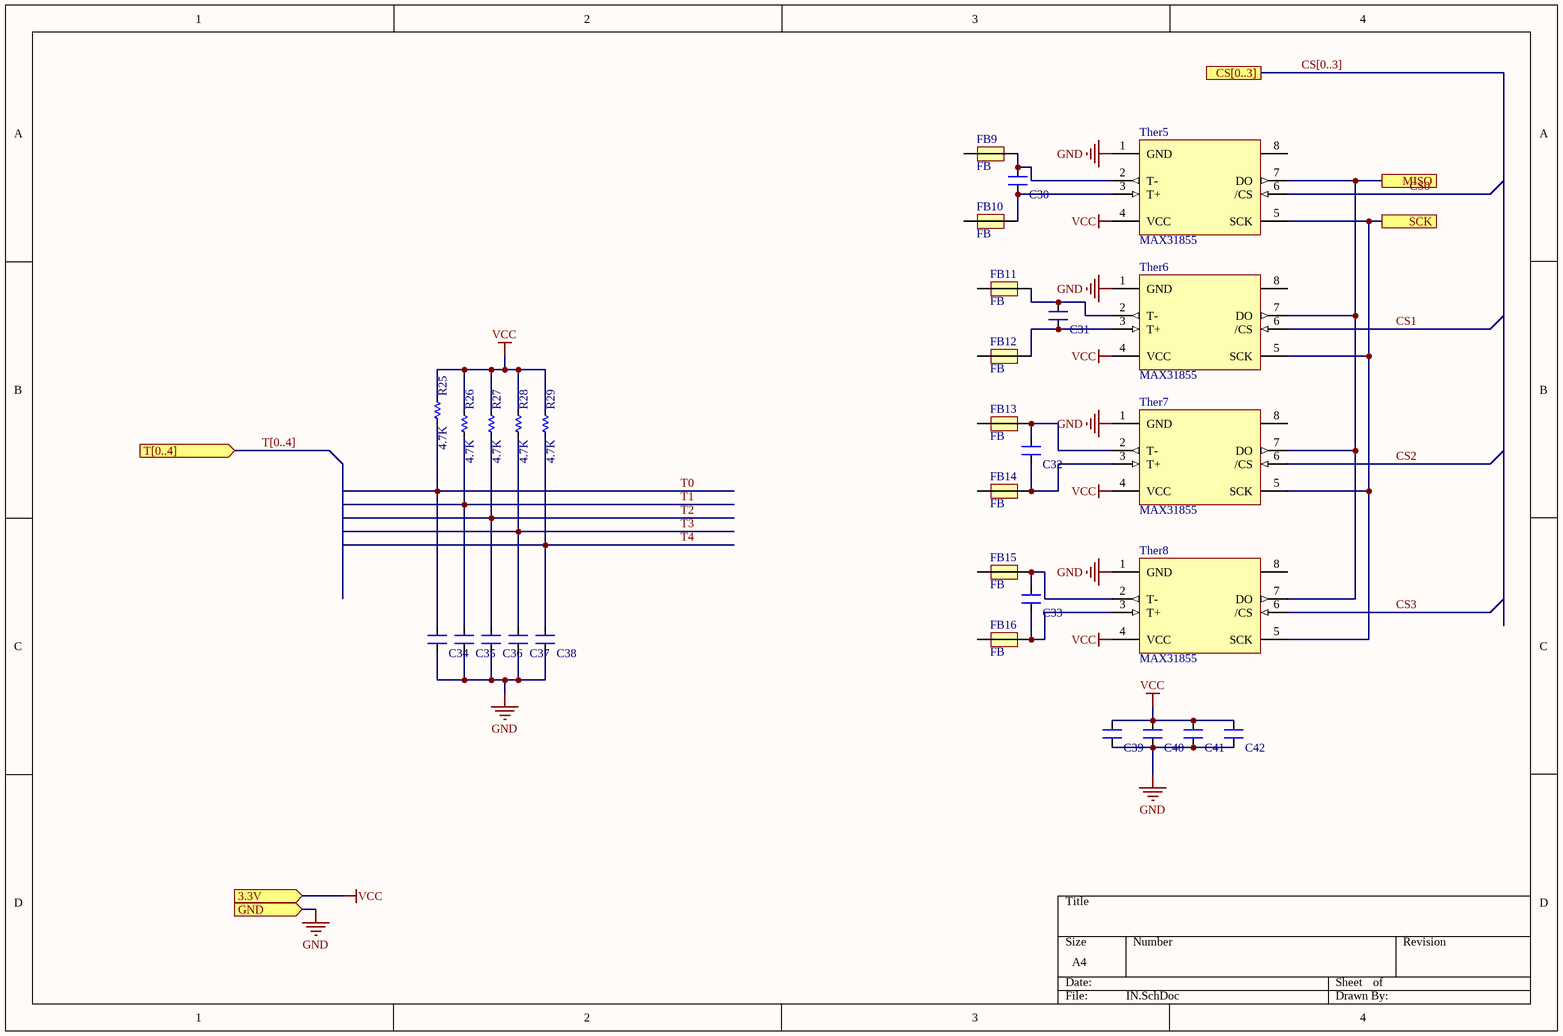
[diagram p11: IN.SchDoc]

### Parts
C30  10nF  [CN-SMD-0603_big]  (value not drawn)
C31  10nF  [CN-SMD-0603_big]  (value not drawn)
C32  10nF  [CN-SMD-0603_big]  (value not drawn)
C33  10nF  [CN-SMD-0603_big]  (value not drawn)
C34  10uF  [CN-SMD-0603_big]  (value not drawn)
C35  10uF  [CN-SMD-0603_big]  (value not drawn)
C36  10uF  [CN-SMD-0603_big]  (value not drawn)
C37  10uF  [CN-SMD-0603_big]  (value not drawn)
C38  10uF  [CN-SMD-0603_big]  (value not drawn)
C39  10nF  [CN-SMD-0603_big]  (value not drawn)
C40  10nF  [CN-SMD-0603_big]  (value not drawn)
C41  10nF  [CN-SMD-0603_big]  (value not drawn)
C42  10nF  [CN-SMD-0603_big]  (value not drawn)
FB9  FB  [Capacitor_805]
FB10  FB  [Capacitor_805]
FB11  FB  [Capacitor_805]
FB12  FB  [Capacitor_805]
FB13  FB  [Capacitor_805]
FB14  FB  [Capacitor_805]
FB15  FB  [Capacitor_805]
FB16  FB  [Capacitor_805]
R25  4.7K  [RES-SMD-0603_BIG]
R26  4.7K  [RES-SMD-0603_BIG]
R27  4.7K  [RES-SMD-0603_BIG]
R28  4.7K  [RES-SMD-0603_BIG]
R29  4.7K  [RES-SMD-0603_BIG]
Ther5  MAX31855  [SO8]
Ther6  MAX31855  [SO8]
Ther7  MAX31855  [SO8]
Ther8  MAX31855  [SO8]

### Ports
3.3V (in), CS[0..3], GND (in), MISO, SCK, T[0..4] (in)

### Nets
GND: C34.1 C35.1 C36.1 C37.1 C38.1 C39.1 C40.1 C41.1 C42.1 Ther5.1(GND) Ther6.1(GND) Ther7.1(GND) Ther8.1(GND) ; port GND
VCC: C39.2 C40.2 C41.2 C42.2 R25.1 R26.1 R27.1 R28.1 R29.1 Ther5.4(VCC) Ther6.4(VCC) Ther7.4(VCC) Ther8.4(VCC) ; port 3.3V  [project net 3.3V]
CS0: Ther5.6(/CS)
CS1: Ther6.6(/CS)
CS2: Ther7.6(/CS)
CS3: Ther8.6(/CS)
T0: C34.2 R25.2
T1: C35.2 R26.2
T2: C36.2 R27.2
T3: C37.2 R28.2
T4: C38.2 R29.2
NetC30_1: C30.1 FB10.2 Ther5.3(T+)
NetC30_2: C30.2 FB9.2 Ther5.2(T-)
NetC31_1: C31.1 FB12.2 Ther6.3(T+)
NetC31_2: C31.2 FB11.2 Ther6.2(T-)
NetC32_1: C32.1 FB14.2 Ther7.3(T+)
NetC32_2: C32.2 FB13.2 Ther7.2(T-)
NetC33_1: C33.1 FB16.2 Ther8.3(T+)
NetC33_2: C33.2 FB15.2 Ther8.2(T-)
NetTher5_5: Ther5.5(SCK) Ther6.5(SCK) Ther7.5(SCK) Ther8.5(SCK) ; port SCK
NetTher5_7: Ther5.7(DO) Ther6.7(DO) Ther7.7(DO) Ther8.7(DO) ; port MISO

Not connected (* = marked no-connect by the designer): FB9 1; FB10 1; FB11 1; FB12 1; FB13 1; FB14 1; FB15 1; FB16 1; Ther5 8; Ther6 8; Ther7 8; Ther8 8

### Buses and harness runs
bus CS[0..3] = port CS[0..3]
bus T[0..4] = port T[0..4]

### Library data of the parts
C30-C42 = CN: Value: 33pF
R25-R29 = R
Ther5-Ther8 = MAX31855: ComponentLink1Description: ADUM1201; ComponentLink1URL: https://thegioiic.com/products/adum1201arz

## Nets that join several sheets
3.3V: mainMARLIN (8 pins), POWER (C5.1 C8.2 U2.2), LIMIT SWITCH/IN1 (R17_IN1.1), LIMIT SWITCH/IN2 (R17_IN2.1), LIMIT SWITCH/IN3 (R17_IN3.1), LIMIT SWITCH/IN4 (R17_IN4.1), LIMIT SWITCH/IN5 (R17_IN5.1), LIMIT SWITCH/IN6 (R17_IN6.1), Ther (5 pins), LCD_SDCARD (5 pins), IN (13 pins)
5V: mainMARLIN (C10.2 Due1.45 HD1.3 HD1.4), POWER (7 pins), DRIVER (12 pins), DRIVER/Driver1 (6 pins), DRIVER/Driver2 (6 pins), DRIVER/Driver3 (6 pins), DRIVER/Driver4 (6 pins), DRIVER/Driver5 (6 pins), LCD_SDCARD (EX1.10 EX3.1), INOUT (7 pins)
+12: mainMARLIN (HD1.1 HD1.2 J1.3), POWER (5 pins), LIMIT SWITCH (5 pins), LIMIT SWITCH/IN1 (R19_IN1.1), LIMIT SWITCH/IN2 (R19_IN2.1), LIMIT SWITCH/IN3 (R19_IN3.1), LIMIT SWITCH/IN4 (R19_IN4.1), LIMIT SWITCH/IN5 (R19_IN5.1), LIMIT SWITCH/IN6 (R19_IN6.1)
GND: mainMARLIN (11 pins), POWER (13 pins), DRIVER (11 pins), DRIVER/Driver1 (6 pins), DRIVER/Driver2 (6 pins), DRIVER/Driver3 (6 pins), DRIVER/Driver4 (6 pins), DRIVER/Driver5 (6 pins), LIMIT SWITCH (5 pins), LIMIT SWITCH/IN1 (C27_IN1.1 U3_IN1.3), LIMIT SWITCH/IN2 (C27_IN2.1 U3_IN2.3), LIMIT SWITCH/IN3 (C27_IN3.1 U3_IN3.3), LIMIT SWITCH/IN4 (C27_IN4.1 U3_IN4.3), LIMIT SWITCH/IN5 (C27_IN5.1 U3_IN5.3), LIMIT SWITCH/IN6 (C27_IN6.1 U3_IN6.3), Ther (13 pins), OUT1 (Q1_OUT1.3 R35_OUT1.1), OUT2 (Q1_OUT2.3 R35_OUT2.1), OUT3 (Q1_OUT3.3 R35_OUT3.1), OUT4 (Q1_OUT4.3 R35_OUT4.1), OUT5 (Q1_OUT5.3 R35_OUT5.1), OUT6 (Q1_OUT6.3 R35_OUT6.1), OUT7 (Q1_OUT7.3 R35_OUT7.1), LCD_SDCARD (15 pins), INOUT (6 pins), IN (13 pins)
A5_CS_SD: mainMARLIN (Due1.35 USB1.1), LCD_SDCARD (EX3.8 IC2.5)
A6_SD_Detect: mainMARLIN (Due1.38 USB1.17), LCD_SDCARD (EX3.5 R22.2)
A8_CS_LCD: mainMARLIN (Due1.62), LCD_SDCARD (EX1.4)
A10_BTN_LCD: mainMARLIN (Due1.60), LCD_SDCARD (EX1.2)
DIR1: mainMARLIN (Due1.88), DRIVER/Driver1 (R38_Driver1.1)
DIR2: mainMARLIN (Due1.25), DRIVER/Driver2 (R38_Driver2.1)
DIR3: mainMARLIN (Due1.91), DRIVER/Driver3 (R38_Driver3.1)
DIR4: mainMARLIN (Due1.95), DRIVER/Driver4 (R38_Driver4.1)
DIR5: mainMARLIN (Due1.100), DRIVER/Driver5 (R38_Driver5.1)
DIR_OUT1: DRIVER (J3.18), DRIVER/Driver1 (3_Driver1.D LED9_Driver1.2 R42_Driver1.2)
DIR_OUT2: DRIVER (J3.15), DRIVER/Driver2 (3_Driver2.D LED9_Driver2.2 R42_Driver2.2)
DIR_OUT3: DRIVER (J3.12), DRIVER/Driver3 (3_Driver3.D LED9_Driver3.2 R42_Driver3.2)
DIR_OUT4: DRIVER (J3.9), DRIVER/Driver4 (3_Driver4.D LED9_Driver4.2 R42_Driver4.2)
DIR_OUT5: DRIVER (J3.6), DRIVER/Driver5 (3_Driver5.D LED9_Driver5.2 R42_Driver5.2)
EN1: mainMARLIN (Due1.26), DRIVER/Driver1 (R36_Driver1.1)
EN2: mainMARLIN (Due1.92), DRIVER/Driver2 (R36_Driver2.1)
EN3: mainMARLIN (Due1.96), DRIVER/Driver3 (R36_Driver3.1)
EN4: mainMARLIN (Due1.97), DRIVER/Driver4 (R36_Driver4.1)
EN5: mainMARLIN (Due1.19), DRIVER/Driver5 (R36_Driver5.1)
EN_OUT1: DRIVER (J3.19), DRIVER/Driver1 (1_Driver1.D LED1_Driver1.2 R40_Driver1.2)
EN_OUT2: DRIVER (J3.16), DRIVER/Driver2 (1_Driver2.D LED1_Driver2.2 R40_Driver2.2)
EN_OUT3: DRIVER (J3.13), DRIVER/Driver3 (1_Driver3.D LED1_Driver3.2 R40_Driver3.2)
EN_OUT4: DRIVER (J3.10), DRIVER/Driver4 (1_Driver4.D LED1_Driver4.2 R40_Driver4.2)
EN_OUT5: DRIVER (J3.7), DRIVER/Driver5 (1_Driver5.D LED1_Driver5.2 R40_Driver5.2)
ENC_EN1: mainMARLIN (Due1.65), LCD_SDCARD (Ex2.5)
ENC_EN2: mainMARLIN (Due1.66), LCD_SDCARD (Ex2.3)
FAN1: mainMARLIN (Due1.113), OUT1 (R34_OUT1.1)
FAN2: mainMARLIN (Due1.116), OUT2 (R34_OUT2.1)
IN1: LIMIT SWITCH (J4.11), LIMIT SWITCH/IN1 (R21_IN1.1)
IN2: LIMIT SWITCH (J4.3), LIMIT SWITCH/IN2 (R21_IN2.1)
IN3: LIMIT SWITCH (J4.10), LIMIT SWITCH/IN3 (R21_IN3.1)
IN4: LIMIT SWITCH (J4.2), LIMIT SWITCH/IN4 (R21_IN4.1)
IN5: LIMIT SWITCH (J4.9), LIMIT SWITCH/IN5 (R21_IN5.1)
IN6: LIMIT SWITCH (J4.1), LIMIT SWITCH/IN6 (R21_IN6.1)
IO_D4: mainMARLIN (Due1.115 HD1.26), LCD_SDCARD (R43.2)
IO_D10: mainMARLIN (Due1.41 HD1.24), LCD_SDCARD (R44.2)
LCD_Beep: mainMARLIN (Due1.87), LCD_SDCARD (EX1.1)
MISO: mainMARLIN (Due1.14 HD1.10 USB1.3), LCD_SDCARD (EX3.9 SD1.7)
MOSI: mainMARLIN (Due1.11 USB1.2), LCD_SDCARD (EX3.10 IC2.9 R45.2)
OUT3: mainMARLIN (Due1.44), OUT3 (R34_OUT3.1)
OUT4: mainMARLIN (Due1.111), OUT4 (R34_OUT4.1)
OUT5: mainMARLIN (Due1.114), OUT5 (R34_OUT5.1)
OUT6: mainMARLIN (Due1.112), OUT6 (R34_OUT6.1)
OUT7: mainMARLIN (Due1.54), OUT7 (R34_OUT7.1)
SCK: mainMARLIN (Due1.12 HD1.8 USB1.4), LCD_SDCARD (EX3.7 IC2.2 R46.2)
STEP1: mainMARLIN (Due1.90), DRIVER/Driver1 (R37_Driver1.1)
STEP2: mainMARLIN (Due1.51), DRIVER/Driver2 (R37_Driver2.1)
STEP3: mainMARLIN (Due1.94), DRIVER/Driver3 (R37_Driver3.1)
STEP4: mainMARLIN (Due1.98), DRIVER/Driver4 (R37_Driver4.1)
STEP5: mainMARLIN (Due1.22), DRIVER/Driver5 (R37_Driver5.1)
STEP_OUT1: DRIVER (J3.17), DRIVER/Driver1 (2_Driver1.D LED8_Driver1.2 R41_Driver1.2)
STEP_OUT2: DRIVER (J3.14), DRIVER/Driver2 (2_Driver2.D LED8_Driver2.2 R41_Driver2.2)
STEP_OUT3: DRIVER (J3.11), DRIVER/Driver3 (2_Driver3.D LED8_Driver3.2 R41_Driver3.2)
STEP_OUT4: DRIVER (J3.8), DRIVER/Driver4 (2_Driver4.D LED8_Driver4.2 R41_Driver4.2)
STEP_OUT5: DRIVER (J3.5), DRIVER/Driver5 (2_Driver5.D LED8_Driver5.2 R41_Driver5.2)